# EAGLE design DR_EIB-128_expandedv1.3 (EAGLE 7.2.0)
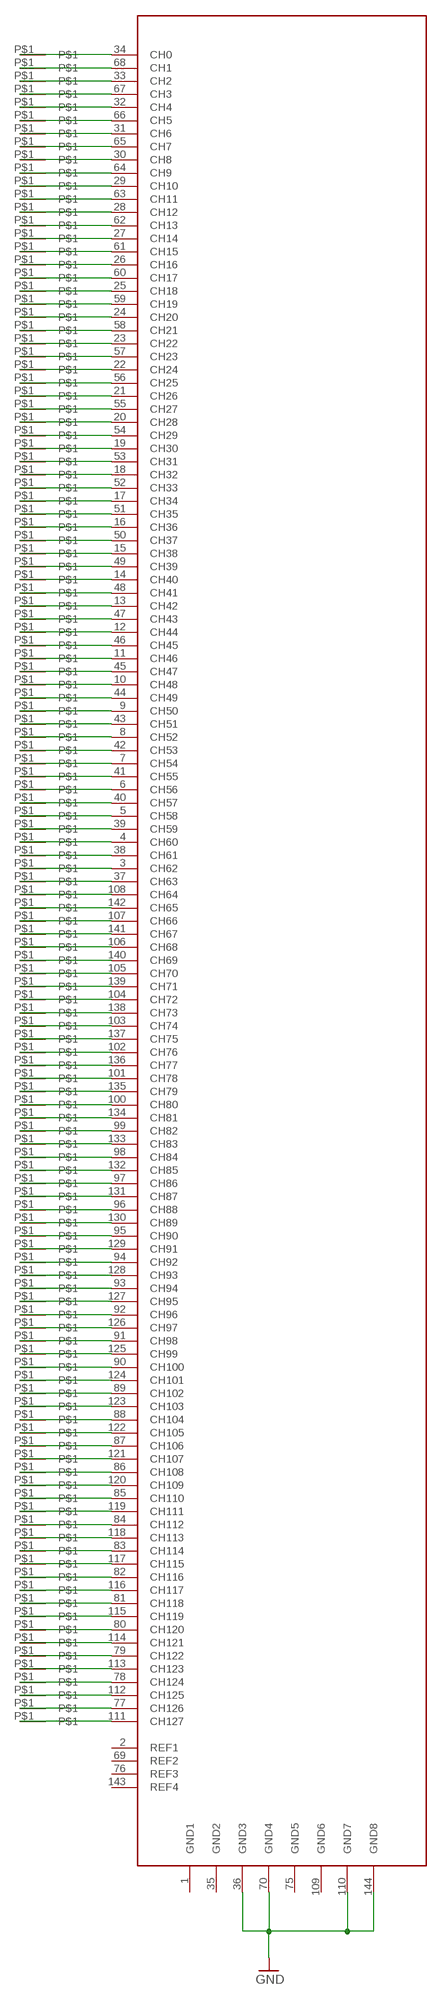
[diagram p0: schematic, sheet 1]

## Parts
H$0  TARRAYSHUTTLEHOLE  [TARRAYSHUTTLEHOLE]
H$1  TARRAYSHUTTLEHOLE  [TARRAYSHUTTLEHOLE]
H$2  TARRAYSHUTTLEHOLE  [TARRAYSHUTTLEHOLE]
H$3  TARRAYSHUTTLEHOLE  [TARRAYSHUTTLEHOLE]
H$4  TARRAYSHUTTLEHOLE  [TARRAYSHUTTLEHOLE]
H$5  TARRAYSHUTTLEHOLE  [TARRAYSHUTTLEHOLE]
H$6  TARRAYSHUTTLEHOLE  [TARRAYSHUTTLEHOLE]
H$7  TARRAYSHUTTLEHOLE  [TARRAYSHUTTLEHOLE]
H$8  TARRAYSHUTTLEHOLE  [TARRAYSHUTTLEHOLE]
H$9  TARRAYSHUTTLEHOLE  [TARRAYSHUTTLEHOLE]
H$10  TARRAYSHUTTLEHOLE  [TARRAYSHUTTLEHOLE]
H$11  TARRAYSHUTTLEHOLE  [TARRAYSHUTTLEHOLE]
H$12  TARRAYSHUTTLEHOLE  [TARRAYSHUTTLEHOLE]
H$13  TARRAYSHUTTLEHOLE  [TARRAYSHUTTLEHOLE]
H$14  TARRAYSHUTTLEHOLE  [TARRAYSHUTTLEHOLE]
H$15  TARRAYSHUTTLEHOLE  [TARRAYSHUTTLEHOLE]
H$16  TARRAYSHUTTLEHOLE  [TARRAYSHUTTLEHOLE]
H$17  TARRAYSHUTTLEHOLE  [TARRAYSHUTTLEHOLE]
H$18  TARRAYSHUTTLEHOLE  [TARRAYSHUTTLEHOLE]
H$19  TARRAYSHUTTLEHOLE  [TARRAYSHUTTLEHOLE]
H$20  TARRAYSHUTTLEHOLE  [TARRAYSHUTTLEHOLE]
H$21  TARRAYSHUTTLEHOLE  [TARRAYSHUTTLEHOLE]
H$22  TARRAYSHUTTLEHOLE  [TARRAYSHUTTLEHOLE]
H$23  TARRAYSHUTTLEHOLE  [TARRAYSHUTTLEHOLE]
H$24  TARRAYSHUTTLEHOLE  [TARRAYSHUTTLEHOLE]
H$25  TARRAYSHUTTLEHOLE  [TARRAYSHUTTLEHOLE]
H$26  TARRAYSHUTTLEHOLE  [TARRAYSHUTTLEHOLE]
H$27  TARRAYSHUTTLEHOLE  [TARRAYSHUTTLEHOLE]
H$28  TARRAYSHUTTLEHOLE  [TARRAYSHUTTLEHOLE]
H$29  TARRAYSHUTTLEHOLE  [TARRAYSHUTTLEHOLE]
H$30  TARRAYSHUTTLEHOLE  [TARRAYSHUTTLEHOLE]
H$31  TARRAYSHUTTLEHOLE  [TARRAYSHUTTLEHOLE]
H$32  TARRAYSHUTTLEHOLE  [TARRAYSHUTTLEHOLE]
H$33  TARRAYSHUTTLEHOLE  [TARRAYSHUTTLEHOLE]
H$34  TARRAYSHUTTLEHOLE  [TARRAYSHUTTLEHOLE]
H$35  TARRAYSHUTTLEHOLE  [TARRAYSHUTTLEHOLE]
H$36  TARRAYSHUTTLEHOLE  [TARRAYSHUTTLEHOLE]
H$37  TARRAYSHUTTLEHOLE  [TARRAYSHUTTLEHOLE]
H$38  TARRAYSHUTTLEHOLE  [TARRAYSHUTTLEHOLE]
H$39  TARRAYSHUTTLEHOLE  [TARRAYSHUTTLEHOLE]
H$40  TARRAYSHUTTLEHOLE  [TARRAYSHUTTLEHOLE]
H$41  TARRAYSHUTTLEHOLE  [TARRAYSHUTTLEHOLE]
H$42  TARRAYSHUTTLEHOLE  [TARRAYSHUTTLEHOLE]
H$43  TARRAYSHUTTLEHOLE  [TARRAYSHUTTLEHOLE]
H$44  TARRAYSHUTTLEHOLE  [TARRAYSHUTTLEHOLE]
H$45  TARRAYSHUTTLEHOLE  [TARRAYSHUTTLEHOLE]
H$46  TARRAYSHUTTLEHOLE  [TARRAYSHUTTLEHOLE]
H$47  TARRAYSHUTTLEHOLE  [TARRAYSHUTTLEHOLE]
H$48  TARRAYSHUTTLEHOLE  [TARRAYSHUTTLEHOLE]
H$49  TARRAYSHUTTLEHOLE  [TARRAYSHUTTLEHOLE]
H$50  TARRAYSHUTTLEHOLE  [TARRAYSHUTTLEHOLE]
H$51  TARRAYSHUTTLEHOLE  [TARRAYSHUTTLEHOLE]
H$52  TARRAYSHUTTLEHOLE  [TARRAYSHUTTLEHOLE]
H$53  TARRAYSHUTTLEHOLE  [TARRAYSHUTTLEHOLE]
H$54  TARRAYSHUTTLEHOLE  [TARRAYSHUTTLEHOLE]
H$55  TARRAYSHUTTLEHOLE  [TARRAYSHUTTLEHOLE]
H$56  TARRAYSHUTTLEHOLE  [TARRAYSHUTTLEHOLE]
H$57  TARRAYSHUTTLEHOLE  [TARRAYSHUTTLEHOLE]
H$58  TARRAYSHUTTLEHOLE  [TARRAYSHUTTLEHOLE]
H$59  TARRAYSHUTTLEHOLE  [TARRAYSHUTTLEHOLE]
H$60  TARRAYSHUTTLEHOLE  [TARRAYSHUTTLEHOLE]
H$61  TARRAYSHUTTLEHOLE  [TARRAYSHUTTLEHOLE]
H$62  TARRAYSHUTTLEHOLE  [TARRAYSHUTTLEHOLE]
H$63  TARRAYSHUTTLEHOLE  [TARRAYSHUTTLEHOLE]
H$64  TARRAYSHUTTLEHOLE  [TARRAYSHUTTLEHOLE]
H$65  TARRAYSHUTTLEHOLE  [TARRAYSHUTTLEHOLE]
H$66  TARRAYSHUTTLEHOLE  [TARRAYSHUTTLEHOLE]
H$67  TARRAYSHUTTLEHOLE  [TARRAYSHUTTLEHOLE]
H$68  TARRAYSHUTTLEHOLE  [TARRAYSHUTTLEHOLE]
H$69  TARRAYSHUTTLEHOLE  [TARRAYSHUTTLEHOLE]
H$70  TARRAYSHUTTLEHOLE  [TARRAYSHUTTLEHOLE]
H$71  TARRAYSHUTTLEHOLE  [TARRAYSHUTTLEHOLE]
H$72  TARRAYSHUTTLEHOLE  [TARRAYSHUTTLEHOLE]
H$73  TARRAYSHUTTLEHOLE  [TARRAYSHUTTLEHOLE]
H$74  TARRAYSHUTTLEHOLE  [TARRAYSHUTTLEHOLE]
H$75  TARRAYSHUTTLEHOLE  [TARRAYSHUTTLEHOLE]
H$76  TARRAYSHUTTLEHOLE  [TARRAYSHUTTLEHOLE]
H$77  TARRAYSHUTTLEHOLE  [TARRAYSHUTTLEHOLE]
H$78  TARRAYSHUTTLEHOLE  [TARRAYSHUTTLEHOLE]
H$79  TARRAYSHUTTLEHOLE  [TARRAYSHUTTLEHOLE]
H$80  TARRAYSHUTTLEHOLE  [TARRAYSHUTTLEHOLE]
H$81  TARRAYSHUTTLEHOLE  [TARRAYSHUTTLEHOLE]
H$82  TARRAYSHUTTLEHOLE  [TARRAYSHUTTLEHOLE]
H$83  TARRAYSHUTTLEHOLE  [TARRAYSHUTTLEHOLE]
H$84  TARRAYSHUTTLEHOLE  [TARRAYSHUTTLEHOLE]
H$85  TARRAYSHUTTLEHOLE  [TARRAYSHUTTLEHOLE]
H$86  TARRAYSHUTTLEHOLE  [TARRAYSHUTTLEHOLE]
H$87  TARRAYSHUTTLEHOLE  [TARRAYSHUTTLEHOLE]
H$88  TARRAYSHUTTLEHOLE  [TARRAYSHUTTLEHOLE]
H$89  TARRAYSHUTTLEHOLE  [TARRAYSHUTTLEHOLE]
H$90  TARRAYSHUTTLEHOLE  [TARRAYSHUTTLEHOLE]
H$91  TARRAYSHUTTLEHOLE  [TARRAYSHUTTLEHOLE]
H$92  TARRAYSHUTTLEHOLE  [TARRAYSHUTTLEHOLE]
H$93  TARRAYSHUTTLEHOLE  [TARRAYSHUTTLEHOLE]
H$94  TARRAYSHUTTLEHOLE  [TARRAYSHUTTLEHOLE]
H$95  TARRAYSHUTTLEHOLE  [TARRAYSHUTTLEHOLE]
H$96  TARRAYSHUTTLEHOLE  [TARRAYSHUTTLEHOLE]
H$97  TARRAYSHUTTLEHOLE  [TARRAYSHUTTLEHOLE]
H$98  TARRAYSHUTTLEHOLE  [TARRAYSHUTTLEHOLE]
H$99  TARRAYSHUTTLEHOLE  [TARRAYSHUTTLEHOLE]
H$100  TARRAYSHUTTLEHOLE  [TARRAYSHUTTLEHOLE]
H$101  TARRAYSHUTTLEHOLE  [TARRAYSHUTTLEHOLE]
H$102  TARRAYSHUTTLEHOLE  [TARRAYSHUTTLEHOLE]
H$103  TARRAYSHUTTLEHOLE  [TARRAYSHUTTLEHOLE]
H$104  TARRAYSHUTTLEHOLE  [TARRAYSHUTTLEHOLE]
H$105  TARRAYSHUTTLEHOLE  [TARRAYSHUTTLEHOLE]
H$106  TARRAYSHUTTLEHOLE  [TARRAYSHUTTLEHOLE]
H$107  TARRAYSHUTTLEHOLE  [TARRAYSHUTTLEHOLE]
H$108  TARRAYSHUTTLEHOLE  [TARRAYSHUTTLEHOLE]
H$109  TARRAYSHUTTLEHOLE  [TARRAYSHUTTLEHOLE]
H$110  TARRAYSHUTTLEHOLE  [TARRAYSHUTTLEHOLE]
H$111  TARRAYSHUTTLEHOLE  [TARRAYSHUTTLEHOLE]
H$112  TARRAYSHUTTLEHOLE  [TARRAYSHUTTLEHOLE]
H$113  TARRAYSHUTTLEHOLE  [TARRAYSHUTTLEHOLE]
H$114  TARRAYSHUTTLEHOLE  [TARRAYSHUTTLEHOLE]
H$115  TARRAYSHUTTLEHOLE  [TARRAYSHUTTLEHOLE]
H$116  TARRAYSHUTTLEHOLE  [TARRAYSHUTTLEHOLE]
H$117  TARRAYSHUTTLEHOLE  [TARRAYSHUTTLEHOLE]
H$118  TARRAYSHUTTLEHOLE  [TARRAYSHUTTLEHOLE]
H$119  TARRAYSHUTTLEHOLE  [TARRAYSHUTTLEHOLE]
H$120  TARRAYSHUTTLEHOLE  [TARRAYSHUTTLEHOLE]
H$121  TARRAYSHUTTLEHOLE  [TARRAYSHUTTLEHOLE]
H$122  TARRAYSHUTTLEHOLE  [TARRAYSHUTTLEHOLE]
H$123  TARRAYSHUTTLEHOLE  [TARRAYSHUTTLEHOLE]
H$124  TARRAYSHUTTLEHOLE  [TARRAYSHUTTLEHOLE]
H$125  TARRAYSHUTTLEHOLE  [TARRAYSHUTTLEHOLE]
H$126  TARRAYSHUTTLEHOLE  [TARRAYSHUTTLEHOLE]
H$127  TARRAYSHUTTLEHOLE  [TARRAYSHUTTLEHOLE]
U$3  128CH-MODULE  [128CH-MODULE]

## Nets
GND: U$3.36(GND3) U$3.70(GND4) U$3.110(GND7) U$3.144(GND8)
N$1: H$0.P$1 U$3.34(CH0)
N$2: H$1.P$1 U$3.68(CH1)
N$3: H$2.P$1 U$3.33(CH2)
N$4: H$3.P$1 U$3.67(CH3)
N$5: H$4.P$1 U$3.32(CH4)
N$6: H$5.P$1 U$3.66(CH5)
N$7: H$6.P$1 U$3.31(CH6)
N$8: H$7.P$1 U$3.65(CH7)
N$9: H$8.P$1 U$3.30(CH8)
N$10: H$9.P$1 U$3.64(CH9)
N$11: H$10.P$1 U$3.29(CH10)
N$12: H$11.P$1 U$3.63(CH11)
N$13: H$12.P$1 U$3.28(CH12)
N$14: H$13.P$1 U$3.62(CH13)
N$15: H$14.P$1 U$3.27(CH14)
N$16: H$15.P$1 U$3.61(CH15)
N$17: H$16.P$1 U$3.26(CH16)
N$18: H$17.P$1 U$3.60(CH17)
N$19: H$18.P$1 U$3.25(CH18)
N$20: H$19.P$1 U$3.59(CH19)
N$21: H$20.P$1 U$3.24(CH20)
N$22: H$21.P$1 U$3.58(CH21)
N$23: H$22.P$1 U$3.23(CH22)
N$24: H$23.P$1 U$3.57(CH23)
N$25: H$24.P$1 U$3.22(CH24)
N$26: H$25.P$1 U$3.56(CH25)
N$27: H$26.P$1 U$3.21(CH26)
N$28: H$27.P$1 U$3.55(CH27)
N$29: H$28.P$1 U$3.20(CH28)
N$30: H$29.P$1 U$3.54(CH29)
N$31: H$30.P$1 U$3.19(CH30)
N$32: H$31.P$1 U$3.53(CH31)
N$33: H$32.P$1 U$3.18(CH32)
N$34: H$33.P$1 U$3.52(CH33)
N$35: H$34.P$1 U$3.17(CH34)
N$36: H$35.P$1 U$3.51(CH35)
N$37: H$36.P$1 U$3.16(CH36)
N$38: H$37.P$1 U$3.50(CH37)
N$39: H$38.P$1 U$3.15(CH38)
N$40: H$39.P$1 U$3.49(CH39)
N$41: H$40.P$1 U$3.14(CH40)
N$42: H$41.P$1 U$3.48(CH41)
N$43: H$42.P$1 U$3.13(CH42)
N$44: H$43.P$1 U$3.47(CH43)
N$45: H$44.P$1 U$3.12(CH44)
N$46: H$45.P$1 U$3.46(CH45)
N$47: H$46.P$1 U$3.11(CH46)
N$48: H$47.P$1 U$3.45(CH47)
N$49: H$48.P$1 U$3.10(CH48)
N$50: H$49.P$1 U$3.44(CH49)
N$51: H$50.P$1 U$3.9(CH50)
N$52: H$51.P$1 U$3.43(CH51)
N$53: H$52.P$1 U$3.8(CH52)
N$54: H$53.P$1 U$3.42(CH53)
N$55: H$54.P$1 U$3.7(CH54)
N$56: H$55.P$1 U$3.41(CH55)
N$57: H$56.P$1 U$3.6(CH56)
N$58: H$57.P$1 U$3.40(CH57)
N$59: H$58.P$1 U$3.5(CH58)
N$60: H$59.P$1 U$3.39(CH59)
N$61: H$60.P$1 U$3.4(CH60)
N$62: H$61.P$1 U$3.38(CH61)
N$63: H$62.P$1 U$3.3(CH62)
N$64: H$63.P$1 U$3.37(CH63)
N$65: H$64.P$1 U$3.108(CH64)
N$66: H$65.P$1 U$3.142(CH65)
N$67: H$66.P$1 U$3.107(CH66)
N$68: H$67.P$1 U$3.141(CH67)
N$69: H$68.P$1 U$3.106(CH68)
N$70: H$69.P$1 U$3.140(CH69)
N$71: H$70.P$1 U$3.105(CH70)
N$72: H$71.P$1 U$3.139(CH71)
N$73: H$72.P$1 U$3.104(CH72)
N$74: H$73.P$1 U$3.138(CH73)
N$75: H$74.P$1 U$3.103(CH74)
N$76: H$75.P$1 U$3.137(CH75)
N$77: H$76.P$1 U$3.102(CH76)
N$78: H$77.P$1 U$3.136(CH77)
N$79: H$78.P$1 U$3.101(CH78)
N$80: H$79.P$1 U$3.135(CH79)
N$81: H$80.P$1 U$3.100(CH80)
N$82: H$81.P$1 U$3.134(CH81)
N$83: H$82.P$1 U$3.99(CH82)
N$84: H$83.P$1 U$3.133(CH83)
N$85: H$84.P$1 U$3.98(CH84)
N$86: H$85.P$1 U$3.132(CH85)
N$87: H$86.P$1 U$3.97(CH86)
N$88: H$87.P$1 U$3.131(CH87)
N$89: H$88.P$1 U$3.96(CH88)
N$90: H$89.P$1 U$3.130(CH89)
N$91: H$90.P$1 U$3.95(CH90)
N$92: H$91.P$1 U$3.129(CH91)
N$93: H$92.P$1 U$3.94(CH92)
N$94: H$93.P$1 U$3.128(CH93)
N$95: H$94.P$1 U$3.93(CH94)
N$96: H$95.P$1 U$3.127(CH95)
N$97: H$96.P$1 U$3.92(CH96)
N$98: H$97.P$1 U$3.126(CH97)
N$99: H$98.P$1 U$3.91(CH98)
N$100: H$99.P$1 U$3.125(CH99)
N$101: H$100.P$1 U$3.90(CH100)
N$102: H$101.P$1 U$3.124(CH101)
N$103: H$102.P$1 U$3.89(CH102)
N$104: H$103.P$1 U$3.123(CH103)
N$105: H$104.P$1 U$3.88(CH104)
N$106: H$105.P$1 U$3.122(CH105)
N$107: H$106.P$1 U$3.87(CH106)
N$108: H$107.P$1 U$3.121(CH107)
N$109: H$108.P$1 U$3.86(CH108)
N$110: H$109.P$1 U$3.120(CH109)
N$111: H$110.P$1 U$3.85(CH110)
N$112: H$111.P$1 U$3.119(CH111)
N$113: H$112.P$1 U$3.84(CH112)
N$114: H$113.P$1 U$3.118(CH113)
N$115: H$114.P$1 U$3.83(CH114)
N$116: H$115.P$1 U$3.117(CH115)
N$117: H$116.P$1 U$3.82(CH116)
N$118: H$117.P$1 U$3.116(CH117)
N$119: H$118.P$1 U$3.81(CH118)
N$120: H$119.P$1 U$3.115(CH119)
N$121: H$120.P$1 U$3.80(CH120)
N$122: H$121.P$1 U$3.114(CH121)
N$123: H$122.P$1 U$3.79(CH122)
N$124: H$123.P$1 U$3.113(CH123)
N$125: H$124.P$1 U$3.78(CH124)
N$126: H$125.P$1 U$3.112(CH125)
N$127: H$126.P$1 U$3.77(CH126)
N$128: H$127.P$1 U$3.111(CH127)
Unconnected: U$3.2(REF1) U$3.69(REF2) U$3.76(REF3) U$3.143(REF4)

## Power pins joined to a net without a drawn wire
GND1: U$3.1(GND1)
GND2: U$3.35(GND2)
GND5: U$3.75(GND5)
GND6: U$3.109(GND6)

## Library data of the parts
H$0 H$1-H$127 = drive-parts:TARRAYSHUTTLEHOLE
U$3 = saanlima:128CH-MODULE

## Board
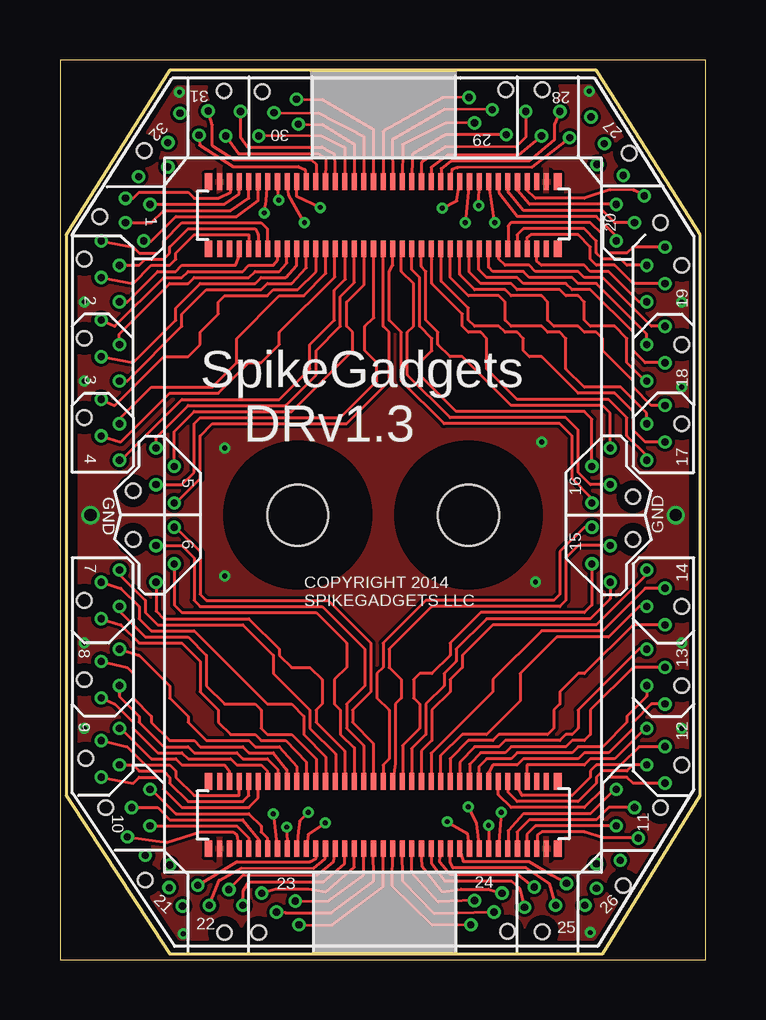
[diagram p1: board, top side]
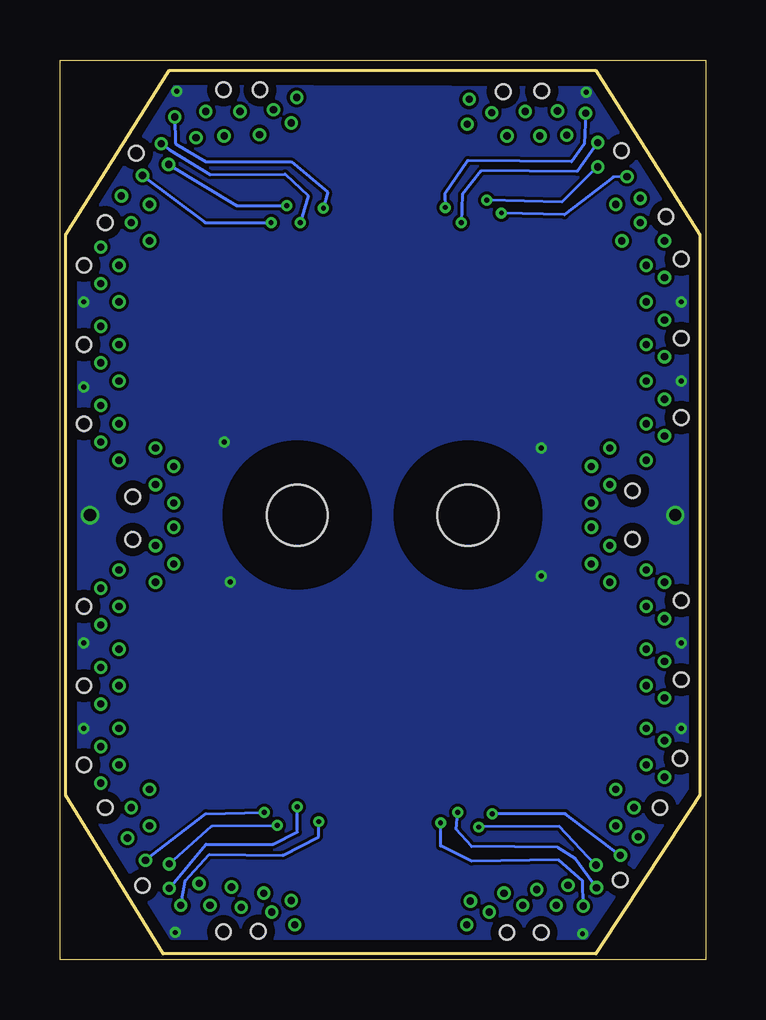
[diagram p2: board, bottom side, seen from below]

Size 26.9 x 37.52 mm. Coordinates in mm from the lower left corner, seen from the top.
Outline: 0,0 26.9,0 26.9,37.52 0,37.52 0,0
Outline: 0.25,30.23 0.25,6.86 4.57,0.25 22.61,0.25 26.67,6.86 26.67,30.23 22.35,37.08 4.57,37.08 0.25,30.23
Copper layers (1*16): Top 0.035mm / dielectric 1.5mm / Bottom 0.035mm
Design rules "Mattias_EIB128": minimum track width 5mil, minimum drill 8mil, track to track 5mil, track to pad 5mil, pad to pad 5mil, via to via 5mil, smd to smd 5mil, copper to edge 15mil, drill to drill 8mil, minimum pad ring 5mil, minimum via ring 5mil, stop-mask expansion 4mil, vias tented up to drill 10mil, thermal gap 10mil
Holes 0.6 mm at 3.56,3.33 6.86,1.14 8.28,1.14 18.64,1.19 20.09,1.17 23.47,3.1 1.02,14.99 1.02,11.68 1.07,8.41 1.91,6.35 3.05,17.53 25.02,6.35 25.91,8.13 25.91,11.43 25.91,14.73 23.88,17.53 3.51,33.73 6.83,36.22 8.43,36.2 18.57,36.27 20.09,36.27 23.72,33.63 23.88,19.3 25.91,22.35 25.91,25.65 25.91,28.96 25.02,30.73 1.65,30.99 3.05,19.56 1.02,22.61 1.02,25.91 1.02,29.21
Holes 2.54 mm at 9.91,18.54 17.02,18.54
tRestrict: area 7,15.6 to 12.8,21.4; area 14.1,15.6 to 19.9,21.4
bRestrict: area 7,15.6 to 12.8,21.4; area 14.1,15.6 to 19.9,21.4

### Footprints (pad centres in the part's own frame; a part is rotated, then mirrored left to right if it is on the bottom)
TARRAYSHUTTLEHOLE = drill 0.3: P$1 0,2.223
128CH-MODULE = smd 0.21 x 0.7: 1 -6.8,11.1; 2 -6.4,11.1; 3 -6,11.1; 4 -5.6,11.1; 5 -5.2,11.1; 6 -4.8,11.1; 7 -4.4,11.1; 8 -4,11.1; 9 -3.6,11.1; 10 -3.2,11.1; 11 -2.8,11.1; 12 -2.4,11.1; 13 -2,11.1; 14 -1.6,11.1; 15 -1.2,11.1; 16 -0.8,11.1; 17 -0.4,11.1; 18 0,11.1; 19 0.4,11.1; 20 0.8,11.1; 21 1.2,11.1; 22 1.6,11.1; 23 2,11.1; 24 2.4,11.1; 25 2.8,11.1; 26 3.2,11.1; 27 3.6,11.1; 28 4,11.1; 29 4.4,11.1; 30 4.8,11.1; 31 5.2,11.1; 32 5.6,11.1; 33 6,11.1; 34 6.4,11.1; 35 6.8,11.1; 36 -6.8,13.9; 37 -6.4,13.9; 38 -6,13.9; 39 -5.6,13.9; 40 -5.2,13.9; 41 -4.8,13.9; 42 -4.4,13.9; 43 -4,13.9; 44 -3.6,13.9; 45 -3.2,13.9; 46 -2.8,13.9; 47 -2.4,13.9; 48 -2,13.9; 49 -1.6,13.9; 50 -1.2,13.9; 51 -0.8,13.9; 52 -0.4,13.9; 53 0,13.9; 54 0.4,13.9; 55 0.8,13.9; 56 1.2,13.9; 57 1.6,13.9; 58 2,13.9; 59 2.4,13.9; 60 2.8,13.9; 61 3.2,13.9; 62 3.6,13.9; 63 4,13.9; 64 4.4,13.9; 65 4.8,13.9; 66 5.2,13.9; 67 5.6,13.9; 68 6,13.9; 69 6.4,13.9; 70 6.8,13.9; 75 6.8,-11.1; 76 6.4,-11.1; 77 6,-11.1; 78 5.6,-11.1; 79 5.2,-11.1; 80 4.8,-11.1; 81 4.4,-11.1; 82 4,-11.1; 83 3.6,-11.1; 84 3.2,-11.1; 85 2.8,-11.1; 86 2.4,-11.1; 87 2,-11.1; 88 1.6,-11.1; 89 1.2,-11.1; 90 0.8,-11.1; 91 0.4,-11.1; 92 0,-11.1; 93 -0.4,-11.1; 94 -0.8,-11.1; 95 -1.2,-11.1; 96 -1.6,-11.1; 97 -2,-11.1; 98 -2.4,-11.1; 99 -2.8,-11.1; 100 -3.2,-11.1; 101 -3.6,-11.1; 102 -4,-11.1; 103 -4.4,-11.1; 104 -4.8,-11.1; 105 -5.2,-11.1; 106 -5.6,-11.1; 107 -6,-11.1; 108 -6.4,-11.1; 109 -6.8,-11.1; 110 6.8,-13.9; 111 6.4,-13.9; 112 6,-13.9; 113 5.6,-13.9; 114 5.2,-13.9; 115 4.8,-13.9; 116 4.4,-13.9; 117 4,-13.9; 118 3.6,-13.9; 119 3.2,-13.9; 120 2.8,-13.9; 121 2.4,-13.9; 122 2,-13.9; 123 1.6,-13.9; 124 1.2,-13.9; 125 0.8,-13.9; 126 0.4,-13.9; 127 0,-13.9; 128 -0.4,-13.9; 129 -0.8,-13.9; 130 -1.2,-13.9; 131 -1.6,-13.9; 132 -2,-13.9; 133 -2.4,-13.9; 134 -2.8,-13.9; 135 -3.2,-13.9; 136 -3.6,-13.9; 137 -4,-13.9; 138 -4.4,-13.9; 139 -4.8,-13.9; 140 -5.2,-13.9; 141 -5.6,-13.9; 142 -6,-13.9; 143 -6.4,-13.9; 144 -6.8,-13.9 | smd 0.33 x 0.7: 71 -7.275,11.1; 72 7.275,11.1; 73 -7.275,13.9; 74 7.275,13.9; 145 7.275,-11.1; 146 -7.275,-11.1; 147 7.275,-13.9; 148 -7.275,-13.9

### Placement (x,y rotation side)
H$0  26.67,27.43 90 top
H$1  26.57,31.85 90 top
H$2  27.43,28.19 90 top
H$3  25.4,31.5 90 top
H$4  26.67,28.96 90 top
H$5  26.16,30.73 90 top
H$6  27.43,29.72 90 top
H$7  25.4,29.97 90 top
H$8  27.43,26.42 90 top
H$9  23.47,34.92 180 bottom
H$10  26.67,25.65 90 top
H$11  22.38,35.38 180 bottom
H$12  27.43,24.89 90 top
H$13  22.68,36.25 180 bottom
H$14  26.67,24.13 90 top
H$15  22.12,37.36 180 bottom
H$16  27.43,23.11 90 top
H$17  21.23,36.5 180 bottom
H$18  26.67,22.35 90 top
H$19  20.83,37.59 180 bottom
H$20  27.43,21.59 90 top
H$21  20.07,36.58 180 bottom
H$22  26.67,20.83 90 top
H$23  19.41,37.59 180 bottom
H$24  25.15,21.34 90 top
H$25  18.59,36.63 180 bottom
H$26  24.38,20.57 90 top
H$27  17.27,37.11 180 bottom
H$28  25.15,19.81 90 top
H$29  18.01,37.67 180 bottom
H$30  24.38,19.05 90 top
H$31  17.04,38.18 180 bottom
H$32  2.54,19.05 270 top
H$33  9.86,38.1 180 bottom
H$34  1.78,19.81 90 bottom
H$35  8.92,37.54 180 bottom
H$36  2.54,20.57 90 bottom
H$37  9.93,37.06 180 bottom
H$38  1.78,21.34 90 bottom
H$39  8.28,36.58 180 bottom
H$40  0.25,20.83 90 bottom
H$41  7.52,37.59 180 bottom
H$42  -0.51,21.84 90 bottom
H$43  6.91,36.58 180 bottom
H$44  0.25,22.35 90 bottom
H$45  6.17,37.62 180 bottom
H$46  -0.51,23.37 90 bottom
H$47  5.79,36.6 180 bottom
H$48  0.25,24.13 90 bottom
H$49  5,37.52 180 bottom
H$50  -0.51,25.15 90 bottom
H$51  4.5,36.3 180 bottom
H$52  0.25,25.65 90 bottom
H$53  4.5,35.28 180 bottom
H$54  -0.51,26.67 90 bottom
H$55  3.28,34.87 180 bottom
H$56  -0.51,29.97 90 bottom
H$57  1.27,29.97 90 bottom
H$58  0.25,28.96 90 bottom
H$59  0.51,30.73 90 bottom
H$60  -0.51,28.45 90 bottom
H$61  1.52,31.5 90 bottom
H$62  0.25,27.43 90 bottom
H$63  0.51,31.75 90 bottom
H$64  0.25,9.65 90 bottom
H$65  0.58,5.13 270 top
H$66  -0.51,9.14 90 bottom
H$67  1.52,5.59 270 top
H$68  0.25,8.13 90 bottom
H$69  0.76,6.35 270 top
H$70  -0.51,7.62 90 bottom
H$71  1.52,7.11 270 top
H$72  -0.51,10.92 90 bottom
H$73  3.56,2.13 0 top
H$74  0.25,11.43 90 bottom
H$75  4.57,1.73 0 top
H$76  -0.51,12.45 90 bottom
H$77  4.55,0.79 0 top
H$78  0.25,12.95 90 bottom
H$79  5.11,0.03 0 top
H$80  -0.51,14.22 90 bottom
H$81  5.74,0.89 0 top
H$82  0.25,14.73 90 bottom
H$83  6.22,0.05 0 top
H$84  -0.51,15.75 90 bottom
H$85  7.04,0.71 0 top
H$86  0.25,16.26 90 bottom
H$87  7.62,0.05 0 top
H$88  1.78,15.75 90 bottom
H$89  8.41,0.56 0 top
H$90  2.54,16.51 90 bottom
H$91  9.8,0.23 0 top
H$92  1.78,17.27 90 bottom
H$93  9.02,-0.23 0 top
H$94  2.54,18.03 90 bottom
H$95  9.96,-0.76 0 top
H$96  24.38,18.03 90 top
H$97  17.12,-0.76 0 top
H$98  25.15,17.27 90 top
H$99  18.08,-0.23 0 top
H$100  24.38,16.51 90 top
H$101  17.27,0.25 0 top
H$102  25.15,15.75 90 top
H$103  18.41,0.56 0 top
H$104  26.67,16.26 90 top
H$105  19.35,-0.03 0 top
H$106  27.43,15.49 90 top
H$107  19.76,0.81 0 top
H$108  26.67,14.73 90 top
H$109  20.65,0.05 0 top
H$110  27.43,13.97 90 top
H$111  21.11,0.97 0 top
H$112  26.67,12.95 90 top
H$113  21.87,0.05 0 top
H$114  27.43,12.19 90 top
H$115  22.35,0.76 0 top
H$116  26.67,11.43 90 top
H$117  22.35,1.78 0 top
H$118  27.43,10.67 90 top
H$119  23.34,1.93 0 top
H$120  27.43,7.37 90 top
H$121  25.4,7.11 90 top
H$122  26.67,8.13 90 top
H$123  26.16,6.35 90 top
H$124  27.43,8.89 90 top
H$125  25.4,5.59 90 top
H$126  26.67,9.65 90 top
H$127  26.31,5.08 90 top
U$3  13.46,18.54 0 top

### Tracks (layer width: path | path; a pad name or v marks a point on that pad's centre or on a via)
GND  (via drill 0.2, 0.51)
  other vias: 6.86,21.34 20.07,21.59 4.98,36.17 22.05,36.22 6.86,16 25.65,18.54 1.27,18.54 5.13,1.09 22.1,1.14 1.02,13.21 1.02,9.65 25.91,13.21 25.91,9.65 25.91,23.88 25.91,27.43 1.02,24.13 1.02,27.43 19.81,15.75
  pour Top: 22.1,36.45 4.85,36.37 0.76,29.97 0.76,7.11 4.98,0.89 22.25,0.89 26.16,7.11 26.16,29.97
  pour Bottom: 22.1,36.45 4.85,36.37 0.76,29.97 0.76,7.11 4.98,0.89 22.25,0.89 26.16,7.11 26.16,29.97
N$1
  Top 0.127: H$0.P$1 24.13,27.43 22.86,28.7 22.1,28.7 21.84,28.96 20.07,28.96 19.86,29.13 19.86,29.59 U$3.34
N$2
  Top 0.127: H$1.P$1 23.9,32.08 22.94,32.11 21.84,31.75 19.81,31.75 19.46,32.08 19.46,32.36 U$3.68
N$3
  Top 0.127: H$2.P$1 23.88,28.19 23.11,28.96 22.35,28.96 22.1,29.21 22.1,29.72 21.59,30.23 19.61,30.23 19.46,30.12 U$3.33
N$4
  Top 0.127: H$3.P$1 19.56,31.5 19.05,32.08 19.02,32.43 U$3.67
N$5
  Top 0.127: H$4.P$1 23.62,28.96 23.37,29.21 22.61,29.21 22.35,29.46 22.35,29.97 21.84,30.48 19.3,30.48 19.05,30.23 19.05,29.65 U$3.32
N$6
  Top 0.127: H$5.P$1 23.11,30.73 22.61,31.24 19.3,31.24 18.67,32 18.64,32.32 U$3.66
N$7
  Top 0.127: H$6.P$1 23.88,29.72 23.62,29.46 22.86,29.46 22.61,29.72 22.61,30.23 22.1,30.73 18.8,30.73 18.67,30.58 18.67,29.86 U$3.31
N$8
  Top 0.127: H$7.P$1 23.18,30.16 22.35,30.99 19.05,30.99 18.31,31.93 18.26,32.26 U$3.65
N$9
  Top 0.127: H$8.P$1 24.64,26.42 22.61,28.45 21.84,28.45 21.59,28.7 19.81,28.7 19.56,28.96 18.54,28.96 18.29,29.21 18.29,29.62 U$3.30
N$10  (via drill 0.2)
  Top 0.127: v18.11,30.73 17.86,32.41 17.86,32.18 U$3.64
  Bottom 0.127: H$9.P$1 20.85,30.73 v18.11,30.73
N$11
  Top 0.127: H$10.P$1 24.45,26.1 22.35,28.19 21.59,28.19 21.34,28.45 19.56,28.45 19.3,28.7 18.03,28.7 17.86,28.88 17.86,29.48 U$3.29
N$12  (via drill 0.2)
  Top 0.127: v17.45,31.45 U$3.63
  Bottom 0.127: H$11.P$1 19.53,31.45 v17.45,31.45
N$13
  Top 0.127: H$12.P$1 24.38,24.89 23.88,25.4 23.88,26.16 22.1,27.94 21.34,27.94 21.08,28.19 19.3,28.19 19.05,28.45 17.78,28.45 17.45,28.78 17.45,29.65 U$3.28
N$14  (via drill 0.2)
  Top 0.127: 17.07,32.41 U$3.62 v16.89,30.73
  Bottom 0.127: H$13.P$1 22.35,33.78 20.65,32.74 17.53,32.77 16.56,31.85 v16.89,30.73
N$15
  Top 0.127: H$14.P$1 24.38,24.13 23.62,24.89 23.62,25.91 23.11,26.42 22.1,26.42 21.84,26.67 21.84,27.43 21.59,27.69 21.08,27.69 20.83,27.94 19.05,27.94 18.8,28.19 17.53,28.19 17.04,28.68 17.04,29.57 U$3.27
N$16  (via drill 0.2)
  Top 0.127: v15.93,31.34 16.54,31.65 U$3.61
  Bottom 0.127: H$15.P$1 22.1,34.04 20.83,33.27 17.27,33.27 15.75,32 v15.93,31.34
N$17
  Top 0.127: H$16.P$1 24.64,23.11 23.88,23.88 23.88,24.13 22.61,25.4 22.61,25.91 22.35,26.16 21.84,26.16 21.59,26.42 20.57,26.42 20.32,26.67 20.32,27.43 20.07,27.69 18.8,27.69 18.54,27.94 17.27,27.94 16.66,28.57 16.66,29.67 U$3.26
N$18
  Top 0.127: H$17.P$1 19.66,33.05 16.56,33.02 16.33,32.94 U$3.60
N$19
  Top 0.127: H$18.P$1 24.45,22.8 23.37,23.88 21.84,23.88 21.08,24.64 21.08,25.91 20.83,26.16 20.32,26.16 20.07,26.42 18.8,26.42 18.54,26.67 18.54,27.43 18.29,27.69 17.02,27.69 16.26,28.45 U$3.25
N$20
  Top 0.127: H$19.P$1 20.6,34.82 20.6,34.19 19.53,33.3 16.28,33.3 15.88,32.99 U$3.59
N$21
  Top 0.127: H$20.P$1 24.38,21.59 23.88,22.1 23.88,22.86 23.11,23.62 21.59,23.62 20.07,25.15 19.56,25.15 19.3,25.4 19.3,25.91 19.05,26.16 18.54,26.16 18.29,26.42 17.27,26.42 17.02,26.67 17.02,27.18 15.88,28.3 15.88,29.25 U$3.24
N$22
  Top 0.127: H$21.P$1 19.1,33.55 16.13,33.55 15.47,33.05 U$3.58
N$23
  Top 0.127: H$22.P$1 24.45,21.02 23.62,21.84 23.62,22.61 22.86,23.37 19.05,23.37 17.78,24.64 17.78,25.91 17.53,26.16 17.02,26.16 16.76,26.42 16.76,26.92 15.49,28.19 15.49,29.2 U$3.23
N$24
  Top 0.127: H$23.P$1 19.41,34.29 19,33.88 16.08,33.91 15.06,33.25 U$3.57
N$25
  Top 0.127: H$24.P$1 22.92,22.8 22.61,23.11 18.8,23.11 16.76,25.15 16.26,25.15 15.75,25.65 15.75,26.16 15.24,26.67 15.24,28.7 15.06,28.91 15.06,29.34 U$3.22
N$26
  Top 0.127: H$25.P$1 16.05,34.39 14.68,33.58 U$3.56
N$27
  Top 0.127: H$26.P$1 22.16,22.54 21.84,22.86 16.51,22.86 14.99,24.38 14.99,24.89 15.49,25.4 15.49,25.91 14.99,26.42 14.99,28.45 14.66,28.78 14.66,29.67 U$3.21
N$28
  Top 0.127: H$27.P$1 16.1,34.9 14.28,33.98 U$3.55
N$29
  Top 0.127: H$28.P$1 22.1,19.81 21.59,20.32 21.59,22.1 21.08,22.61 16.26,22.61 14.48,24.38 14.48,26.16 14.73,26.42 14.73,28.19 14.22,28.7 14.22,29.6 U$3.20
N$30
  Top 0.127: H$29.P$1 16.03,35.46 13.84,34.19 U$3.54
N$31
  Top 0.127: H$30.P$1 22.16,19.24 21.34,20.07 21.34,21.84 20.83,22.35 16,22.35 14.22,24.13 14.22,26.16 13.72,26.67 13.72,28.7 13.87,28.96 13.87,29.53 U$3.19
N$32
  Top 0.127: H$31.P$1 15.95,35.94 13.46,34.54 U$3.53
N$33
  Top 0.127: H$32.P$1 4.83,19.05 5.84,20.07 5.84,21.84 6.35,22.35 11.94,22.35 13.72,24.13 13.72,26.16 13.46,26.42 U$3.18
N$34
  Top 0.127: H$33.P$1 10.95,35.87 13.06,34.62 U$3.52
N$35
  Top 0.127: H$34.P$1 5.08,19.81 5.59,20.32 5.59,22.35 5.84,22.61 11.68,22.61 13.21,24.13 13.21,24.89 12.7,25.4 12.7,26.42 13.08,26.77 13.08,29.28 U$3.17
N$36
  Top 0.127: H$35.P$1 10.79,35.31 12.65,34.34 U$3.51
N$37
  Top 0.127: H$36.P$1 4.76,22.04 5.59,22.86 9.65,22.86 12.19,25.4 12.19,26.16 11.94,26.42 11.94,27.43 12.68,28.14 12.68,29.55 U$3.16
N$38
  Top 0.127: H$37.P$1 10.95,34.82 12.27,34.01 U$3.50
N$39
  Top 0.127: H$38.P$1 4,21.78 5.33,23.11 9.4,23.11 10.67,24.38 10.67,25.4 11.68,26.42 11.68,27.66 12.27,28.25 12.27,29.6 U$3.15
N$40
  Top 0.127: U$3.49 11.86,33.88 10.92,34.34 H$39.P$1
N$41
  Top 0.127: H$40.P$1 2.54,20.83 5.08,23.37 9.14,23.37 10.41,24.64 10.41,25.65 11.43,26.67 11.43,27.91 11.89,28.37 11.89,29.49 U$3.14
N$42
  Top 0.127: H$41.P$1 7.52,34.31 7.82,33.88 10.92,33.88 11.43,33.6 U$3.48
N$43
  Top 0.127: U$3.13 11.46,28.47 9.14,26.16 9.14,25.65 8.38,24.89 7.87,24.89 6.6,23.62 4.57,23.62 2.54,21.59 H$42.P$1
N$44
  Top 0.127: H$43.P$1 7.44,33.6 10.77,33.6 11.07,33.38 U$3.47
N$45
  Top 0.127: U$3.12 11.07,29.45 11.07,28.63 10.16,27.69 9.14,27.69 7.37,25.91 7.37,24.89 6.35,23.88 3.81,23.88 2.48,22.54 H$44.P$1
N$46
  Top 0.127: U$3.46 10.67,33.17 10.46,33.35 7.26,33.35 6.35,33.93 6.35,34.8 H$45.P$1
N$47
  Top 0.127: U$3.11 10.67,28.7 9.91,27.94 8.89,27.94 8.64,27.69 6.86,27.69 6.6,27.43 6.6,26.92 5.84,26.16 5.84,25.65 5.33,25.15 4.32,25.15 2.29,23.11 H$46.P$1
N$48
  Top 0.127: H$47.P$1 5.82,33.96 7.21,33.07 9.93,33.07 10.21,32.94 U$3.45
N$49
  Top 0.127: H$48.P$1 2.79,24.13 5.08,26.42 5.08,26.92 6.1,27.94 8.38,27.94 8.64,28.19 9.65,28.19 10.26,28.85 10.26,29.74 U$3.10
N$50  (via drill 0.2)
  Top 0.127: v10.85,31.37 9.86,31.83 9.86,31.9 U$3.44
  Bottom 0.127: H$49.P$1 5.05,34.01 5.59,33.27 9.91,33.33 10.87,31.93 v10.85,31.37
N$51
  Top 0.127: H$50.P$1 3.05,24.89 4.83,26.67 4.83,27.18 5.84,28.19 8.13,28.19 8.38,28.45 9.4,28.45 9.86,28.96 9.86,29.67 U$3.9
N$52  (via drill 0.2)
  Top 0.127: v10.19,30.73 9.53,31.88 U$3.43
  Bottom 0.127: H$51.P$1 5.36,32.87 9.35,32.89 10.13,31.9 v10.19,30.73
N$53
  Top 0.127: H$52.P$1 2.48,26.1 4.57,28.19 5.33,28.19 5.59,28.45 7.87,28.45 8.13,28.7 9.14,28.7 9.45,29.06 9.45,29.7 U$3.8
N$54  (via drill 0.2)
  Top 0.127: v9.12,31.67 U$3.42
  Bottom 0.127: H$53.P$1 4.39,33.2 5.99,31.6 v9.12,31.67
N$55
  Top 0.127: H$54.P$1 2.29,26.42 4.32,28.45 5.08,28.45 5.33,28.7 7.62,28.7 7.87,28.96 8.89,28.96 9.07,29.18 9.07,29.56 U$3.7
N$56  (via drill 0.2)
  Top 0.127: v8.51,31.14 8.59,31.65 U$3.41
  Bottom 0.127: H$55.P$1 3.86,32.64 5.89,31.06 v8.51,31.14
N$57
  Top 0.127: H$56.P$1 3.05,29.72 3.3,29.46 4.06,29.46 4.32,29.72 4.32,29.97 5.08,30.73 8.38,30.73 8.64,30.48 8.64,29.67 U$3.6
N$58
  Top 0.127: H$57.P$1 3.81,29.97 4.83,30.99 7.37,30.99 8.26,31.65 8.26,32.46 U$3.40
N$59
  Top 0.127: H$58.P$1 3.3,28.96 3.56,29.21 4.32,29.21 4.57,29.46 4.57,29.72 5.33,30.48 8.13,30.48 8.26,30.23 8.26,29.76 U$3.5
N$60
  Top 0.127: H$59.P$1 3.81,30.73 4.32,31.24 7.11,31.24 7.87,31.75 7.87,32.43 U$3.39
N$61
  Top 0.127: H$60.P$1 3.05,28.19 3.81,28.96 4.57,28.96 4.83,29.21 4.83,29.46 5.59,30.23 7.87,30.23 7.87,29.65 U$3.4
N$62
  Top 0.127: H$61.P$1 6.86,31.5 7.47,31.93 7.47,32.52 U$3.38
N$63
  Top 0.127: H$62.P$1 2.79,27.43 4.06,28.7 4.83,28.7 5.08,28.96 7.32,28.96 7.47,29.34 U$3.3
N$64
  Top 0.127: H$63.P$1 3.05,31.75 3.3,32 5.33,32 5.59,31.75 6.6,31.75 7.11,32 7.11,32.39 U$3.37
N$65
  Top 0.127: H$64.P$1 2.54,9.65 3.81,8.38 4.83,8.38 5.08,8.13 6.86,8.13 7.06,7.87 7.06,7.49 U$3.108
N$66
  Top 0.127: H$65.P$1 4.45,4.9 5.84,5.33 7.19,5.33 7.37,5.21 U$3.142
N$67
  Top 0.127: H$66.P$1 2.79,8.89 3.56,8.13 4.57,8.13 4.83,7.87 4.83,7.62 5.59,6.86 7.47,6.86 7.47,7.35 U$3.107
N$68
  Top 0.127: H$67.P$1 7.37,5.59 7.87,5.08 7.87,4.65 U$3.141
N$69
  Top 0.127: H$68.P$1 3.05,8.13 3.3,7.87 4.32,7.87 4.57,7.62 4.57,7.37 5.33,6.6 7.62,6.6 7.87,6.86 7.87,7.43 U$3.106
N$70
  Top 0.127: H$69.P$1 4.06,6.35 4.57,5.84 7.62,5.84 8.28,5.03 8.28,4.47 U$3.140
N$71
  Top 0.127: H$70.P$1 3.05,7.37 3.3,7.62 4.06,7.62 4.32,7.37 4.32,7.11 5.08,6.35 7.87,6.35 8.26,6.76 8.26,7.46 U$3.105
N$72
  Top 0.127: H$71.P$1 3.81,7.11 4.83,6.1 7.87,6.1 8.38,5.59 8.38,5.33 8.64,5.08 8.64,4.67 U$3.139
N$73
  Top 0.127: H$72.P$1 2.29,10.67 3.05,9.91 3.05,9.65 4.06,8.64 5.08,8.64 5.33,8.38 7.11,8.38 7.37,8.13 8.38,8.13 8.64,7.87 8.64,7.47 U$3.104
N$74  (via drill 0.2)
  Top 0.127: v8.89,6.1 U$3.138
  Bottom 0.127: H$73.P$1 5.84,6.1 v8.89,6.1
N$75
  Top 0.127: H$74.P$1 2.48,10.99 3.3,10.16 3.3,9.91 4.32,8.89 5.33,8.89 5.59,8.64 7.37,8.64 7.62,8.38 8.64,8.38 9.07,7.95 U$3.103
N$76  (via drill 0.2)
  Top 0.127: v9.45,5.54 U$3.137
  Bottom 0.127: H$75.P$1 6.1,5.56 v9.45,5.54
N$77
  Top 0.127: H$76.P$1 2.79,12.19 3.05,11.94 3.05,10.92 3.81,10.16 3.81,9.91 4.57,9.14 5.59,9.14 5.84,8.89 7.62,8.89 7.87,8.64 8.89,8.64 9.45,7.92 9.45,7.48 U$3.102
N$78  (via drill 0.2)
  Top 0.127: v10.34,6.15 9.98,5.79 9.93,5.36 U$3.136
  Bottom 0.127: v10.34,6.15 10.39,5.44 9.75,4.72 6.17,4.7 5.44,4.24 H$77.P$1
N$79
  Top 0.127: H$78.P$1 3.3,12.7 4.57,11.43 4.57,10.92 5.33,10.16 5.33,9.91 6.1,9.14 7.87,9.14 8.13,8.89 9.14,8.89 9.86,8.08 U$3.101
N$80  (via drill 0.2)
  Top 0.127: v11.05,5.71 10.34,5.23 U$3.135
  Bottom 0.127: H$79.P$1 5.13,3.3 6.12,4.17 9.75,4.12 11.05,4.75 v11.05,5.71
N$81
  Top 0.127: H$80.P$1 2.54,13.97 3.3,13.21 5.08,13.21 5.84,12.45 5.84,11.18 6.6,10.41 6.6,9.91 7.11,9.4 8.13,9.4 8.38,9.14 9.4,9.14 10.26,8.26 10.26,7.42 U$3.100
N$82
  Top 0.127: H$81.P$1 7.37,4.09 10.41,4.09 10.67,4.24 U$3.134
N$83
  Top 0.127: H$82.P$1 2.48,14.54 3.56,13.46 5.33,13.46 6.1,12.7 6.1,11.43 6.86,10.67 8.13,10.67 8.38,10.41 8.38,9.65 8.64,9.4 9.65,9.4 10.67,8.38 U$3.99
N$84
  Top 0.127: H$83.P$1 6.63,3.33 7.57,3.83 10.57,3.81 11.05,4.22 U$3.133
N$85
  Top 0.127: H$84.P$1 2.54,15.49 3.3,14.73 3.3,14.22 3.81,13.72 5.59,13.72 8.64,10.67 9.65,10.67 10.16,10.16 10.16,9.4 11.07,8.46 11.07,7.4 U$3.98
N$86
  Top 0.127: H$85.P$1 7.64,3.56 10.72,3.53 11.4,4.09 U$3.132
N$87
  Top 0.127: H$86.P$1 2.48,16.07 3.56,14.99 3.56,14.48 4.06,13.97 7.62,13.97 8.89,12.7 8.89,11.94 10.41,10.41 10.41,9.65 11.48,8.59 11.48,7.42 U$3.97
N$88
  Top 0.127: H$87.P$1 7.64,2.87 7.87,3.25 11,3.25 11.86,4.01 U$3.131
N$89
  Top 0.127: H$88.P$1 4,14.54 4.32,14.22 7.87,14.22 9.14,12.95 9.14,12.7 9.65,12.19 10.41,12.19 10.92,11.68 10.92,10.67 10.67,10.41 10.67,9.91 11.86,8.71 11.86,7.59 U$3.96
N$90
  Top 0.127: U$3.130 12.27,3.86 11.07,2.82 10.36,2.95 8.99,2.95 H$89.P$1
N$91
  Top 0.127: H$90.P$1 4.76,14.8 5.08,14.48 10.67,14.48 11.94,13.21 11.94,12.19 11.43,11.68 11.43,10.67 11.68,10.41 11.68,9.4 12.27,8.84 12.27,7.46 U$3.95
N$92
  Top 0.127: H$91.P$1 11.2,2.46 12.65,3.53 U$3.129
N$93
  Top 0.127: H$92.P$1 5.08,17.27 5.59,16.76 5.59,14.99 5.84,14.73 10.92,14.73 12.7,12.95 12.7,11.43 11.94,10.67 11.94,9.65 12.65,8.94 12.65,7.53 U$3.94
N$94
  Top 0.127: U$3.128 13.08,3.28 11.3,1.96 9.4,1.96 H$93.P$1
N$95
  Top 0.127: H$94.P$1 4.83,18.03 5.84,17.02 5.84,15.24 6.1,14.99 11.18,14.99 12.95,13.21 12.95,11.18 12.19,10.41 12.19,9.91 13.06,9.02 13.06,7.42 U$3.93
N$96
  Top 0.127: H$95.P$1 11.33,1.45 13.46,3.05 U$3.127
N$97
  Top 0.127: H$96.P$1 21.84,18.03 20.83,17.02 20.83,15.24 20.57,14.99 15.24,14.99 13.46,13.21 13.46,12.19 13.21,11.94 13.21,10.92 13.72,10.41 13.72,8.38 13.46,8.13 U$3.92
N$98
  Top 0.127: H$97.P$1 15.52,1.45 13.84,3.07 U$3.126
N$99
  Top 0.127: H$98.P$1 21.59,17.27 21.08,16.76 21.08,14.99 20.83,14.73 15.49,14.73 13.72,12.95 13.72,12.19 14.22,11.68 14.22,10.92 13.97,10.67 13.97,8.19 U$3.91
N$100
  Top 0.127: H$99.P$1 15.6,1.93 14.28,3.28 U$3.125
N$101
  Top 0.127: H$100.P$1 22.16,14.8 21.84,14.48 17.53,14.48 16.26,13.21 16.26,12.7 15.49,11.94 14.99,11.94 14.73,11.68 14.73,10.92 14.99,10.67 14.99,9.65 14.28,8.94 14.28,7.53 U$3.90
N$102
  Top 0.127: H$101.P$1 15.75,2.41 14.66,3.63 U$3.124
N$103
  Top 0.127: H$102.P$1 22.92,15.05 22.1,14.22 17.78,14.22 16.51,12.95 16.51,12.45 16,11.94 16,11.43 15.24,10.67 15.24,9.4 14.66,8.81 14.66,7.8 U$3.89
N$104
  Top 0.127: U$3.123 15.09,3.89 15.9,2.85 16.71,2.95 17.86,2.95 H$103.P$1
N$105
  Top 0.127: H$104.P$1 24.45,16.07 22.35,13.97 18.03,13.97 16.76,12.7 16.76,12.19 16.26,11.68 16.26,11.18 15.49,10.41 15.49,9.14 15.06,8.71 15.06,7.59 U$3.88
N$106
  Top 0.127: H$105.P$1 19.18,2.97 18.82,3.28 16.03,3.28 15.49,4.01 U$3.122
N$107
  Top 0.127: H$106.P$1 24.38,15.49 22.61,13.72 20.07,13.72 18.03,11.68 18.03,11.18 15.47,8.61 U$3.87
N$108
  Top 0.127: H$107.P$1 19.1,3.56 16.26,3.56 15.82,4.06 U$3.121
N$109
  Top 0.127: H$108.P$1 24.13,14.73 22.86,13.46 20.7,13.46 19.18,11.94 19.18,10.79 17.78,9.4 16.76,9.4 15.85,8.51 15.85,7.46 U$3.86
N$110
  Top 0.127: H$109.P$1 20.4,3.17 19.43,3.83 16.38,3.83 16.26,4.06 U$3.120
N$111
  Top 0.127: H$110.P$1 23.88,13.97 21.84,11.94 21.59,11.94 20.83,11.18 20.83,10.67 20.57,10.41 20.57,9.65 20.32,9.4 18.29,9.4 18.03,9.14 17.02,9.14 16.26,8.38 U$3.85
N$112
  Top 0.127: H$111.P$1 20.5,3.53 19.56,4.09 16.82,4.09 U$3.119
N$113
  Top 0.127: U$3.84 16.66,7.39 16.66,8.23 17.27,8.89 18.29,8.89 18.54,9.14 20.83,9.14 21.08,9.4 21.34,9.4 21.59,9.65 21.59,10.41 24.13,12.95 H$112.P$1
N$114  (via drill 0.2)
  Top 0.127: v16.13,5.77 16.97,5.28 U$3.118
  Bottom 0.127: H$113.P$1 21.69,3.3 20.68,4.39 17.63,4.37 16.13,5.13 v16.13,5.77
N$115
  Top 0.127: H$114.P$1 23.88,12.19 22.1,10.41 22.1,9.4 21.84,9.14 21.34,9.14 21.08,8.89 18.8,8.89 18.54,8.64 17.53,8.64 17.07,8.15 17.07,7.51 U$3.83
N$116  (via drill 0.2)
  Top 0.127: v17.02,6.38 17.35,5.69 U$3.117
  Bottom 0.127: H$115.P$1 20.83,4.83 18.03,4.83 17.02,5.33 v17.02,6.38
N$117
  Top 0.127: H$116.P$1 24.45,10.99 23.62,10.16 23.62,9.91 22.61,8.89 21.59,8.89 21.34,8.64 19.05,8.64 18.8,8.38 17.78,8.38 17.45,8.05 U$3.82
N$118  (via drill 0.2)
  Top 0.127: v17.86,5.61 U$3.116
  Bottom 0.127: H$117.P$1 20.57,5.59 v17.86,5.61
N$119
  Top 0.127: H$118.P$1 24.64,10.67 23.88,9.91 23.88,9.65 22.86,8.64 21.84,8.64 21.59,8.38 19.3,8.38 19.05,8.13 18.03,8.13 17.86,7.82 17.86,7.47 U$3.81
N$120  (via drill 0.2)
  Top 0.127: v18.39,6.15 U$3.115
  Bottom 0.127: H$119.P$1 20.83,6.1 v18.39,6.15
N$121
  Top 0.127: H$120.P$1 23.88,7.37 23.62,7.62 22.86,7.62 22.61,7.37 22.61,7.11 21.84,6.35 18.8,6.35 18.26,6.88 U$3.80
N$122
  Top 0.127: H$121.P$1 23.11,7.11 22.1,6.1 19.3,6.1 18.67,5.38 18.67,4.57 U$3.114
N$123
  Top 0.127: H$122.P$1 23.88,8.13 23.62,7.87 22.61,7.87 22.35,7.62 22.35,7.37 21.59,6.6 19.05,6.6 18.67,6.99 U$3.79
N$124
  Top 0.127: H$123.P$1 22.86,6.35 22.35,5.84 19.56,5.84 19.05,5.33 19.05,4.65 U$3.113
N$125
  Top 0.127: H$124.P$1 24.13,8.89 23.37,8.13 22.35,8.13 22.1,7.87 22.1,7.62 21.34,6.86 19.25,6.86 19.07,7.2 U$3.78
N$126
  Top 0.127: H$125.P$1 19.81,5.59 19.46,5.23 U$3.112
N$127
  Top 0.127: H$126.P$1 24.38,9.65 23.11,8.38 22.1,8.38 21.84,8.13 19.46,8.13 19.46,7.54 U$3.77
N$128
  Top 0.127: 19.86,4.59 U$3.111 19.89,5.21 20.07,5.33 21.84,5.33 22.61,5.08 H$127.P$1

### Text on the board
tPlace: 31 | 28 | 32 | 30 | 27 | 29 | 1 | 20 | 2 | 19 | 3 | 18 | SpikeGadgets / DRv1.3 | 4 | 17 | 5 | GND | GND | 16 | 6 | GND | 7 | 15 | 14 | COPYRIGHT 2014 / SPIKEGADGETS LLC | 8 | 13 | 9 | 12 | 10 | 11 | 23 | 24 | 21 | 26 | 22 | 25